# EAGLE schematic oldkb (EAGLE 9.6.2)
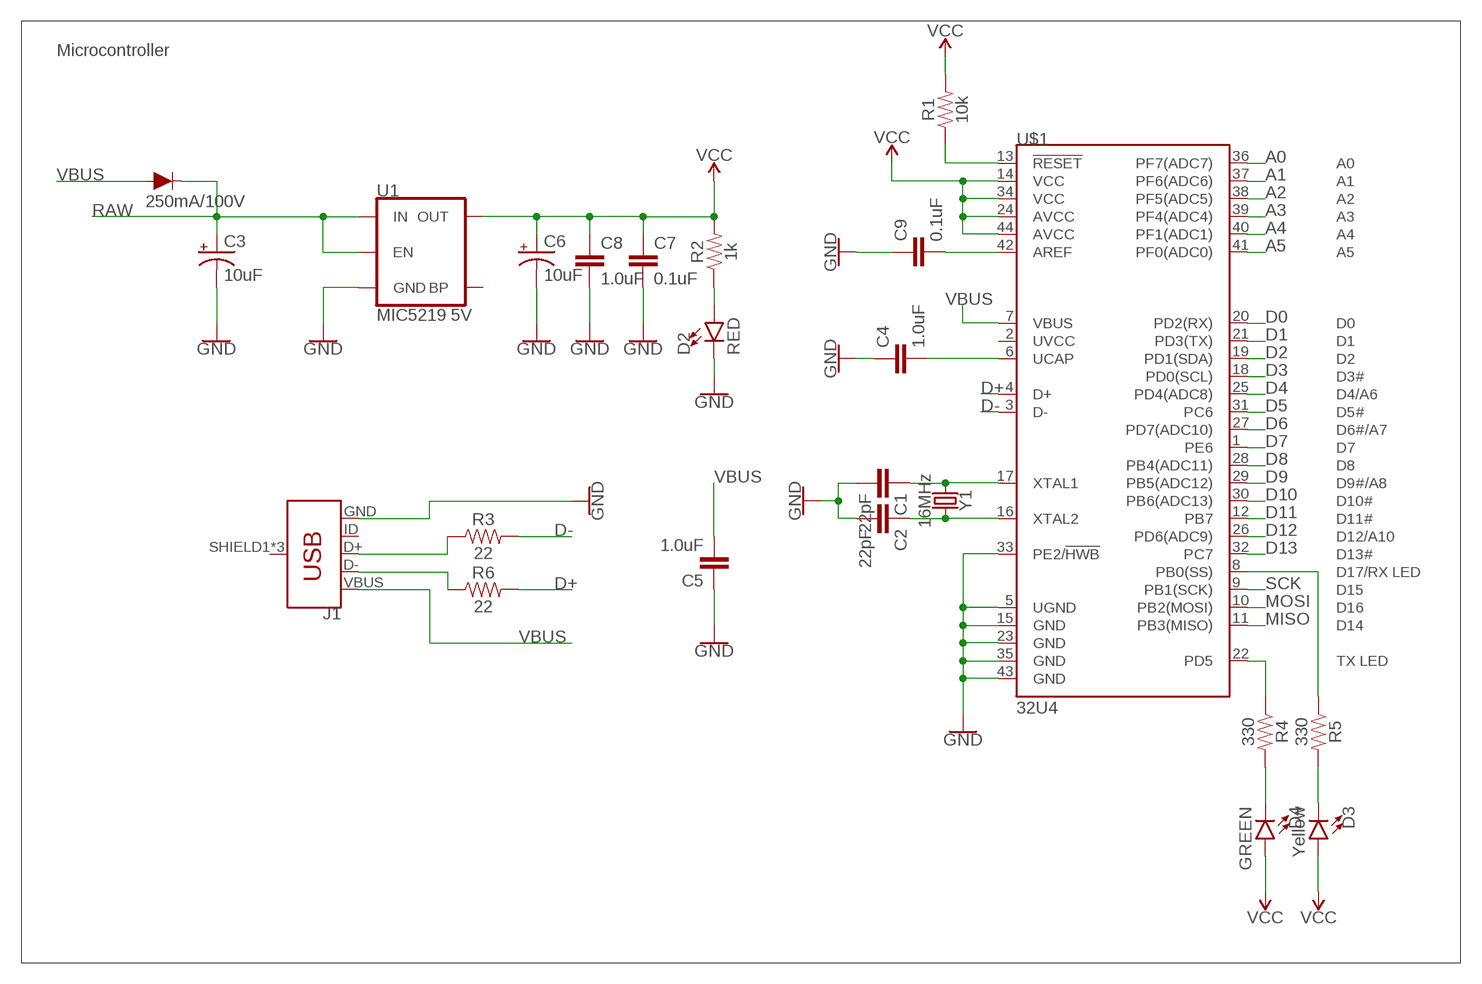
[diagram p0: schematic, sheet 1]

## Parts
C1  22pF  22PF-0603-50V-5%  [0603]
C2  22pF  22PF-0603-50V-5%  [0603]
C3  10uF  10UF-POLAR-0603-6.3V-20%(TANT)  [0603-POLAR]
C4  1.0uF  1.0UF-0603-16V-10%  [0603]
C5  1.0uF  1.0UF-0603-16V-10%  [0603]
C6  10uF  10UF-POLAR-0603-6.3V-20%(TANT)  [0603-POLAR]
C7  0.1uF  0.1UF-0603-25V-(+80/-20%)  [0603]
C8  1.0uF  1.0UF-0603-16V-10%  [0603]
C9  0.1uF  0.1UF-0603-25V-(+80/-20%)  [0603]
D1  250mA/100V  DIODE-BAS16J  [SOD-323]
D2  RED  LED-RED0603  [LED-0603]
D3  Yellow  LED-YELLOW0603  [LED-0603]
D4  GREEN  LED-GREEN0603  [LED-0603]
J1  USB_MICRO-B_FEMALE-SMT  [USB-B-MICRO-SMD]
R1  10k  10KOHM-0603-1/10W-1%  [0603]
R2  1k  1KOHM-0603-1/10W-1%  [0603]
R3  22  22OHM-0603-1/10W-1%  [0603]
R4  330  330OHM-0603-1/10W-1%  [0603]
R5  330  330OHM-0603-1/10W-1%  [0603]
R6  22  22OHM-0603-1/10W-1%  [0603]
U1  MIC5219 5V  V_REG_MIC52195V  [SOT23-5]
U$1  32U4  ATMEGA32U4TQFP-44  [TQFP44]
Y1  16MHz  CRYSTAL-16MHZSMD-5X3.2  [CRYSTAL-SMD-5X3.2-4PAD]

## Nets
A0: U$1.36(PF7(ADC7))
A1: U$1.37(PF6(ADC6))
A2: U$1.38(PF5(ADC5))
A3: U$1.39(PF4(ADC4))
A4: U$1.40(PF1(ADC1))
A5: U$1.41(PF0(ADC0))
D0: U$1.20(PD2(RX))
D1: U$1.21(PD3(TX))
D2: U$1.19(PD1(SDA))
D3: U$1.18(PD0(SCL))
D4: U$1.25(PD4(ADC8))
D5: U$1.31(PC6)
D6: U$1.27(PD7(ADC10))
D7: U$1.1(PE6)
D8: U$1.28(PB4(ADC11))
D9: U$1.29(PB5(ADC12))
D10: U$1.30(PB6(ADC13))
D11: U$1.12(PB7)
D12: U$1.26(PD6(ADC9))
D13: U$1.32(PC7)
D+: R6.2 U$1.4(D+)
D-: R3.2 U$1.3(D-)
GND: C1.2 C2.2 C3.- C4.1 C5.1 C6.- C7.2 C8.2 C9.1 D2.C J1.GND U1.2(GND) U$1.5(UGND) U$1.15(GND) U$1.23(GND) U$1.33(PE2/!HWB) U$1.35(GND) U$1.43(GND)
MISO: U$1.11(PB3(MISO))
MOSI: U$1.10(PB2(MOSI))
N$1: D2.A R2.1
N$2: J1.D+ R3.1
N$3: J1.D- R6.1
N$4: R1.1 U$1.13(!RESET)
N$5: C9.2 U$1.42(AREF)
N$7: C4.2 U$1.6(UCAP)
N$9: C1.1 U$1.17(XTAL1) Y1.1
N$10: C2.1 U$1.16(XTAL2) Y1.3
N$12: R4.1 U$1.22(PD5)
N$13: D4.C R4.2
N$14: D3.C R5.2
N$15: R5.1 U$1.8(PB0(SS))
RAW: C3.+ D1.C U1.1(IN) U1.3(EN)
SCK: U$1.9(PB1(SCK))
VBUS: C5.2 C6.+ C7.1 C8.1 D1.A J1.VBUS R2.2 U1.5(OUT) U$1.7(VBUS) ; supply symbol labelled VCC
VCC: D3.A D4.A R1.2 U$1.14(VCC) U$1.24(AVCC) U$1.34(VCC) U$1.44(AVCC)
Unconnected: J1.ID J1.SHIELD1(SHIELD) J1.SHIELD2(SHIELD) J1.SHIELD3(SHIELD) U1.4(BP) U$1.2(UVCC)

## Notes on the sheet
- Microcontroller

## Library data of the parts
C1 C2 = SparkFun-Capacitors:22PF: 22pF ceramic capacitors A capacitor is a passive two-terminal electrical component used to store electrical energy temporarily in an electric field.; PROD_ID: CAP-07876
C3 C6 = SparkFun-Capacitors:10UF-POLAR: 10.0µF polarized capacitors A capacitor is a passive two-terminal electrical component used to store electrical energy temporarily in an electric field.; PROD_ID: CAP-13210
C4 C5 C8 = SparkFun-Capacitors:1.0UF: 1µF ceramic capacitors A capacitor is a passive two-terminal electrical component used to store electrical energy temporarily in an electric field.; PROD_ID: CAP-00868
C7 C9 = SparkFun-Capacitors:0.1UF: 0.1µF ceramic capacitors A capacitor is a passive two-terminal electrical component used to store electrical energy temporarily in an electric field.; PROD_ID: CAP-00810
D1 = SparkFun-DiscreteSemi:DIODE: Diode These are standard reverse protection diodes and small signal diodes. SparkFun Products: SparkFun SparkPunk Sound Kit <https://www.sparkfun.com/products/11177> SparkFun ESP8266 Thing <https://www.sparkfun.com/products/13231>; PROD_ID: DIO-09646
D2 = SparkFun-LED:LED-RED: Red SMD LED Used in manufacturing of most products at SparkFun Packages: 0603 - SMD 0603 package [Product Link] <http://docs.avagotech.com/docs/AV02-0551EN> 0603 SMART - SMD 0603 SMART package ( more efficient and expensive)[Product Link] <http://www.osram-os.com/Graphics/XPic2/00077099_0.pdf> 1206 - SMD1206 package [Product Link] <https://www.sparkfun.com/datasheets/DevTools/LilyPad/Q150OVS4.pdff> SparkFun Products: Pro Mini 328 -5V <https://www.sparkfun.com/products/821> RedBoard <https://www.sparkfun.com/products/12757> IOIO-OTG <https://www.sparkfun.com/products/13613>; PROD_ID: DIO-00819
D3 = SparkFun-LED:LED-YELLOW: Yellow SMD LED Used in manufacturing several products at SparkFun. Packages: 0603 - SMD 0603 package[Product Link] <http://www.kingbrightusa.com/product.asp?catalog_name=LED&product_id=APT1608SYCK> 0603 -SMART - SMART SMD 0603 package (more efficient/more expensive) [Product Link] <http://www.osram-os.com/osram_os/en/products/product-catalog/led-light-emitting-diodes/smartled-0603/ly-l29k/index.jsp> LilyPad - SMD1206 package[Product Datasheet] <https://www.sparkfun.com/datasheets/DevTools/LilyPad/Q150YUS4.pdf> SparkFun Products: Blynk Board <https://www.sparkfun.com/products/13794> IOIO-OTG <https://www.sparkfun.com/products/13613> XBee Explorer Serial <https://www.sparkfun.com/products/13225>; PROD_ID: DIO-09003
D4 = SparkFun-LED:LED-GREEN: Green SMD LED Used in manufacturing of various products at SparkFun Packages: 0603 - SMD 0603 package [Product Link] <http://www.futureelectronics.com/en/technologies/semiconductors/optoelectronics/leds/Pages/9894312-LTST-C190GKT.aspx?CrossPart=HSMG-C190&IM=0> LilyPad 1206 - SMD1206 LilyPad package [Product Link] <http://www.futureelectronics.com/en/Technologies/Product.aspx?ProductID=IN150NGHARVATEKCORPORATION2049943&IM=0> 1206 - SMD1206 package [Product Link] <http://www.futureelectronics.com/en/technologies/semiconductors/optoelectronics/leds/Pages/8315665-LTST-C150KGKT.aspx?IM=0> 1206 Bottom Mount -SMD 1206 Bottom Mount [Product Link] <http://www.digikey.com/product-detail/en/lite-on-inc/LTST-C230KGKT/160-1456-1-ND/386854> SparkFun Products: Pro Mini 328 -5V <https://www.sparkfun.com/products/821> RedBoard <https://www.sparkfun.com/products/12757> MP3 Trigger <https://www.sparkfun.com/products/13720> Makey Makey <https://www.sparkfun.com/products/11076>; PROD_ID: DIO-00821
J1 = SparkFun-Connectors:USB_MICRO-B: USB Type Micro-B Connector Male/female and PTH/SMT variants SparkFun Products: SparkFun microB USB Breakout <https://www.sparkfun.com/products/12035> SparkFun USB microB Plug Breakout <https://www.sparkfun.com/products/10031> SparkFun ESP8266 Thing <https://www.sparkfun.com/products/13231>; PROD_ID: CONN-11752
R1 = SparkFun-Resistors:10KOHM: 10kΩ resistor A resistor is a passive two-terminal electrical component that implements electrical resistance as a circuit element. Resistors act to reduce current flow, and, at the same time, act to lower voltage levels within circuits. - Wikipedia; PROD_ID: RES-00824
R2 = SparkFun-Resistors:1KOHM: 1kΩ resistor A resistor is a passive two-terminal electrical component that implements electrical resistance as a circuit element. Resistors act to reduce current flow, and, at the same time, act to lower voltage levels within circuits. - Wikipedia; PROD_ID: RES-07856
R3 R6 = SparkFun-Resistors:22OHM: 22Ω resistor A resistor is a passive two-terminal electrical component that implements electrical resistance as a circuit element. Resistors act to reduce current flow, and, at the same time, act to lower voltage levels within circuits. - Wikipedia; PROD_ID: RES-08698
R4 R5 = SparkFun-Resistors:330OHM: 330Ω resistor A resistor is a passive two-terminal electrical component that implements electrical resistance as a circuit element. Resistors act to reduce current flow, and, at the same time, act to lower voltage levels within circuits. - Wikipedia; PROD_ID: RES-00818
U1 = SparkFun-IC-Power:V_REG_MIC5219: V_REG MIC5219 Standard 3.3V and 5V 500mA LDO voltage regulator in SOT-23 layout. Micrel part MIC5219. BP (by-pass) pin is used to lower output noise with 470pF cap, may be left open.; PROD_ID: VREG-10107
U$1 = SparkFun-IC-Microcontroller:ATMEGA32U4: Atmel MCU, 32KByte Atmel 44-pin 8-bit Microcontroller with 32KBytes of ISP Flash and USB Controller Datasheet <http://cdn.sparkfun.com/datasheets/Dev/Arduino/Boards/ATMega32U4.pdf> SparkFun Products LilyPad Arduino USB - ATmega32U4 Board <https://www.sparkfun.com/products/12049> (DEV-12049) Pro Micro - 5V/16MHz <https://www.sparkfun.com/products/12640> (DEV-12640) Pro Micro - 3.3V/8MHz <https://www.sparkfun.com/products/12587> (DEV-12587) Fio v3 - ATmega32U4 <https://www.sparkfun.com/products/11520> (DEV-11520) Qduino Mini <https://www.sparkfun.com/products/13614> (DEV-13614) Makey Makey - Standard Kit <https://www.sparkfun.com/products/11511> (WIG-11511) Makey Makey Deluxe Kit <https://www.sparkfun.com/products/11519> (WIG-11519); PROD_ID: IC-11161
Y1 = SparkFun-Clocks:CRYSTAL-16MHZ: 16MHz Crystal Digikey Example <http://www.digikey.com/product-search/en?keywords=535-9122-1-ND> Frequency: 16MHz Frequency Stability: ±50ppm Frequency Tolerance: ±20ppm Load Capacitance: 18pF SparkFun Products: Pro Micro -5V/16MHz <https://www.sparkfun.com/products/12640> SparkFun Serial Enabled LCD Kit <https://www.sparkfun.com/products/10097>; PROD_ID: XTAL-08218; SF_ID: COM-00094